# EasyEDA Pro project Z轴转接板-光耦.eprj

# Schematic 原理图

## Sheets
1 主控MCU: Board Name: XZ转接板; Create Date: 2024-04-22; Page Name: 主控MCU; Project Name: XZ转接板; Schematic Name: 原理图; Update Date: 2025-05-16; Company: 嘉立创EDA; Page Size: A3; Version: V1.0
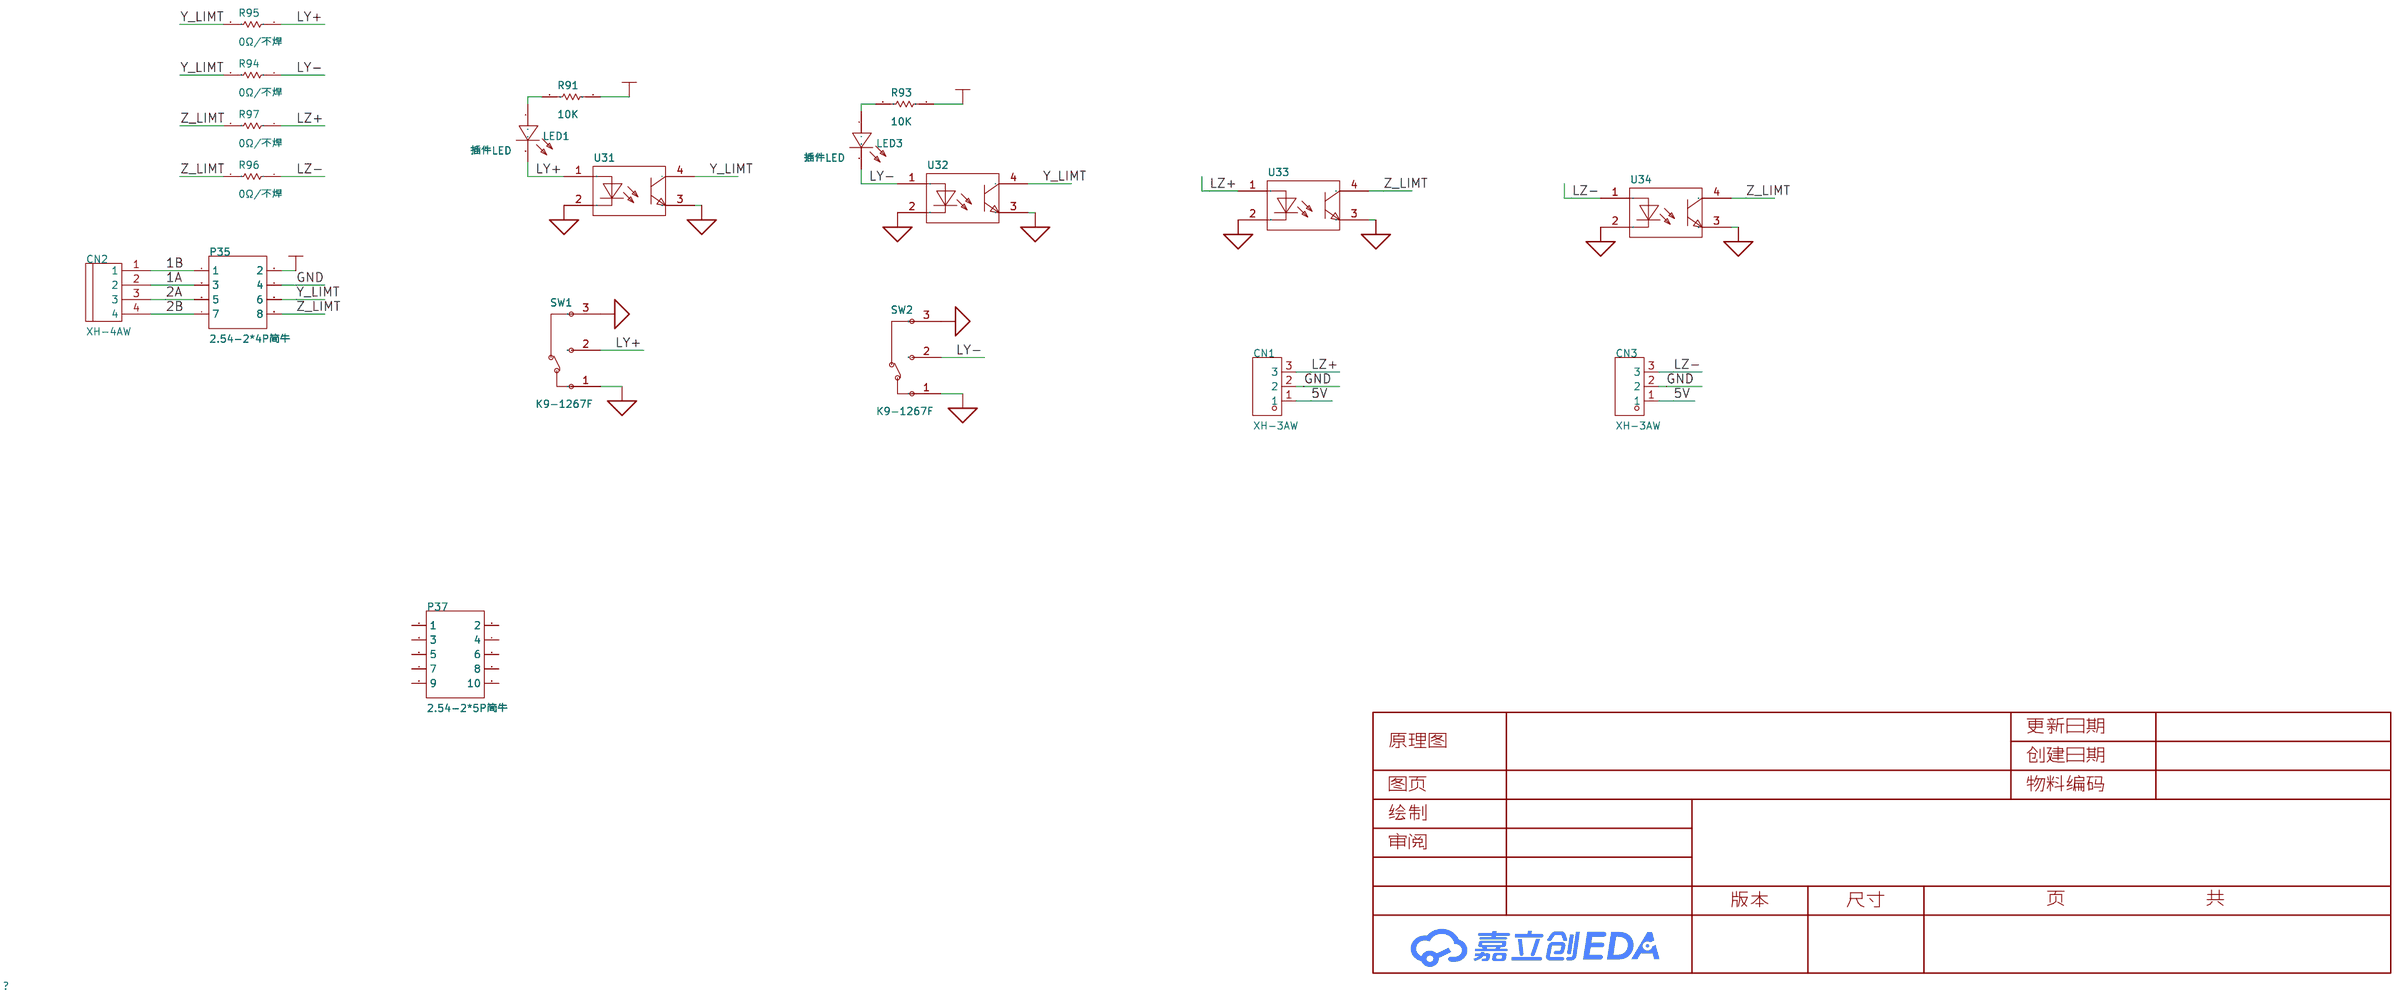
[diagram p0: 主控MCU]
2 电源及控制: Board Name: 转接隔离板; Create Date: 2024-12-30; Page Name: 电源及控制; Project Name: 延时继电器; Update Date: 2025-04-08
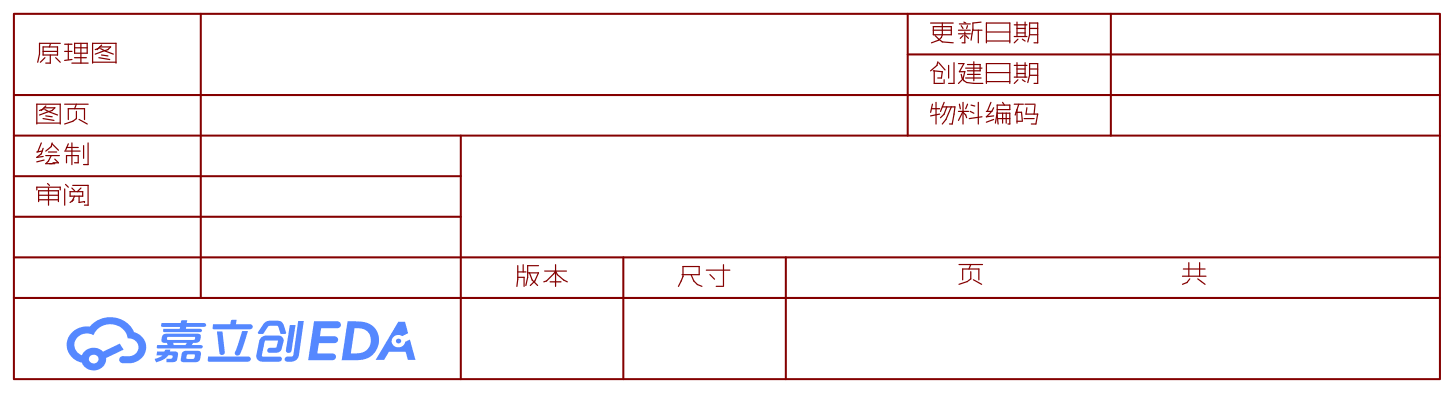
[diagram p1: 电源及控制]

## Parts
CN1  XH-3AW  [CONN-TH_3P-P2.50_XH-3A]
CN2  XH-4AW  [CONN-TH_XH2.54-4AW]
CN3  XH-3AW  [CONN-TH_3P-P2.50_XH-3A]
LED1  插件LED  [LED-TH_BD3.8-P2.54-FD]
LED3  插件LED  [LED-TH_BD3.8-P2.54-FD]
P35  2.54-2*4P简牛  [IDC-TH_8P-P2.54-V-R2-C4-S2.54]
P37  2.54-2*5P简牛  [IDC-TH_10P-P2.54_C5665]
R91  10K  [0603R]
R93  10K  [0603R]
R94  0Ω/不焊  [0603R]
R95  0Ω/不焊  [0603R]
R96  0Ω/不焊  [0603R]
R97  0Ω/不焊  [0603R]
SW1  K9-1267F  [SW-TH_K9-1267F]
SW2  K9-1267F  [SW-TH_K9-1267F]
U31  LTV-357T-C  [SOP-4_L4.4-W3.9-P2.54-LS7.0-TL]
U32  LTV-357T-C  [SOP-4_L4.4-W3.9-P2.54-LS7.0-TL]
U33  LTV-357T-C  [SOP-4_L4.4-W3.9-P2.54-LS7.0-TL]
U34  LTV-357T-C  [SOP-4_L4.4-W3.9-P2.54-LS7.0-TL]

## Library data of the parts
CN1 CN3 = XH-3AW: LCSC Part Name: XH-3AW，3P，脚距2.5mm，卧插 卧插; Supplier Part: C18428; Manufacturer: BOOMELE(博穆精密); Supplier Footprint: 插件,P=2.5mm; JLCPCB Part Class: Extended Part; Datasheet: https://atta.szlcsc.com/upload/public/pdf/source/20151222/1457707638029.pdf; Supplier: LCSC; Reference Series: XH; Pitch: 2.5mm; Pins Structure: 1x3P; Number of Rows: 1; Number of PINs Per Row: 3
CN2 = XH-4AW: LCSC Part Name: XH-4AW，4P，脚距2.5mm，卧插; Supplier Part: C21273; Manufacturer: BOOMELE(博穆精密); Supplier Footprint: 插件,P=2.5mm; JLCPCB Part Class: Extended Part; Datasheet: https://atta.szlcsc.com/upload/public/pdf/source/20170919/C21273_1505787293543977054.pdf; Supplier: LCSC; Reference Series: XH; Pitch: 2.5mm; Pins Structure: 1x4P; Number of Rows: 1; Number of PINs Per Row: 4; Contact Material: 磷青铜
LED1 LED3 = 204-10SURC/S530-A3-L: LCSC Part Name: 红灯; Supplier Part: C264302; Manufacturer: EVERLIGHT(台湾亿光); Supplier Footprint: 插件,D=3mm; JLCPCB Part Class: Extended Part; Datasheet: https://atta.szlcsc.com/upload/public/pdf/source/20181204/C264302_3C164FC09690301AE5D79DE2C4875559.pdf; Supplier: LCSC; Emitted Color: 红灯
P35 = 2.54-2*4P简牛: LCSC Part Name: 2.54mm 每排P数:4 排数:2; Supplier Part: C9135; Manufacturer: BOOMELE(博穆精密); Supplier Footprint: 插件,P=2.54mm; JLCPCB Part Class: Extended Part; Datasheet: https://atta.szlcsc.com/upload/public/pdf/source/20131122/1457706661290.pdf; Supplier: LCSC; Connector Type: 简牛座; Pitch: 2.54mm; Pin Number in each Row: 4; Number of Rows: 2; Row Spacing: 2.54mm; Holder Type: 直插
P37 = 2.54-2*5P简牛: LCSC Part Name: 2.54mm 每排P数:5 排数:2; Supplier Part: C5665; Manufacturer: BOOMELE(博穆精密); Supplier Footprint: 插件,P=2.54mm; JLCPCB Part Class: Extended Part; Datasheet: https://atta.szlcsc.com/upload/public/pdf/source/20140331/1457707037896.pdf; Supplier: LCSC; Connector Type: 简牛座; Pitch: 2.54mm; Pin Number in each Row: 5; Number of Rows: 2; Row Spacing: 2.54mm; Holder Type: 直插
R91 R93-R97 = 1K: Resistor; Published: 8-Jun-2000; LatestRevisionDate: 17-Jul-2002; LatestRevisionNote: Re-released for DXP Platform.; PackageReference: AXIAL-0.3; Publisher: Altium Limited; Origin Footprint 2: AXIAL-0.3; Origin Footprint 3: R0805; Origin Footprint 4: 0805R; Design Item ID: RES; Library Name: SCH封装库
SW1 SW2 = K9-1267F: LCSC Part Name: 弧形压柄300万次寿命小微动 12.7mm*5.7mm; Supplier Part: C107263; Manufacturer: 韩国韩荣; Supplier Footprint: 插件; JLCPCB Part Class: Extended Part; Datasheet: https://atta.szlcsc.com/upload/public/pdf/source/20201214/C107263_D9656DE761E5BF43078859A56D7E33A8.pdf; Supplier: LCSC; Type: 微动开关; Contact Current (DC): 100mA; Voltage Rating (DC): 30V; Contact Current (AC): 1A; Voltage Rating (AC): 125V; Circuit: 单刀双掷; Mechanical Life: 3000000; Operating Temperature: -25℃~+85℃; Switch Length: 12.7mm; Switch Width: 5.7mm; Switch Height: 12.8mm
U31-U34 = LTV-357T-C: 输入电压类型:DC;正向电压:1.2V;输出电流:50mA;隔离电压(rms):3.75kV;反向电压:6V;接收端电压:35V;输出通道数:1;集射极饱和电压(Vce(sat)@Ic,IF):200mV@1mA,20mA;; Supplier: LCSC; Manufacturer: LITEON(光宝); Supplier Part: C119091; JLCPCB Part Class: 扩展库; LCSC Part Name: DC输入隔离电压(rms):3750V; Supplier Footprint: SOP-4-2.54mm; Datasheet: https://atta.szlcsc.com/upload/public/pdf/source/20170930/C133128_1506736380934997376.pdf; Input voltage type: DC; Output Type: 光电三极管; Forward Voltage: 1.2V; Output Current: 50mA; Isolation Voltage(rms): 3.75kV; Reverse Voltage: 6V; Receiving End Voltage: 35V; Number of Outputs: 1; Collector-Emitter Saturation Voltage (Vce(sat)@Ic,IF): 200mV@1mA,20mA; Rise time: 4us@2mA,100Ω; Fall time: 3us@2mA,100Ω; Operating Temperature: -55℃~+110℃

## Nets
5V: CN1.1 CN3.1 P35.2 R91.1 R93.1
GND: CN1.2 CN3.2 P35.4 SW1.1(C) SW1.3(NC) SW2.1(C) SW2.3(NC) U31.2 U31.3 U32.2 U32.3 U33.2 U33.3 U34.2 U34.3
1A: CN2.2 P35.3
1B: CN2.1 P35.1
2A: CN2.3 P35.5
2B: CN2.4 P35.7
LY+: LED1.2(K) R95.1 SW1.2(NO) U31.1
LY-: LED3.2(K) R94.1 SW2.2(NO) U32.1
LZ+: CN1.3 R97.1 U33.1
LZ-: CN3.3 R96.1 U34.1
Y_LIMT: P35.6 R94.2 R95.2 U31.4 U32.4
Z_LIMT: P35.8 R96.2 R97.2 U33.4 U34.4
$1N78046: LED1.1(A) R91.2
$1N78221: LED3.1(A) R93.2

Not connected (* = marked no-connect by the designer): P37 1 2 3 4 5 6 7 8 9 10

# Board PCB
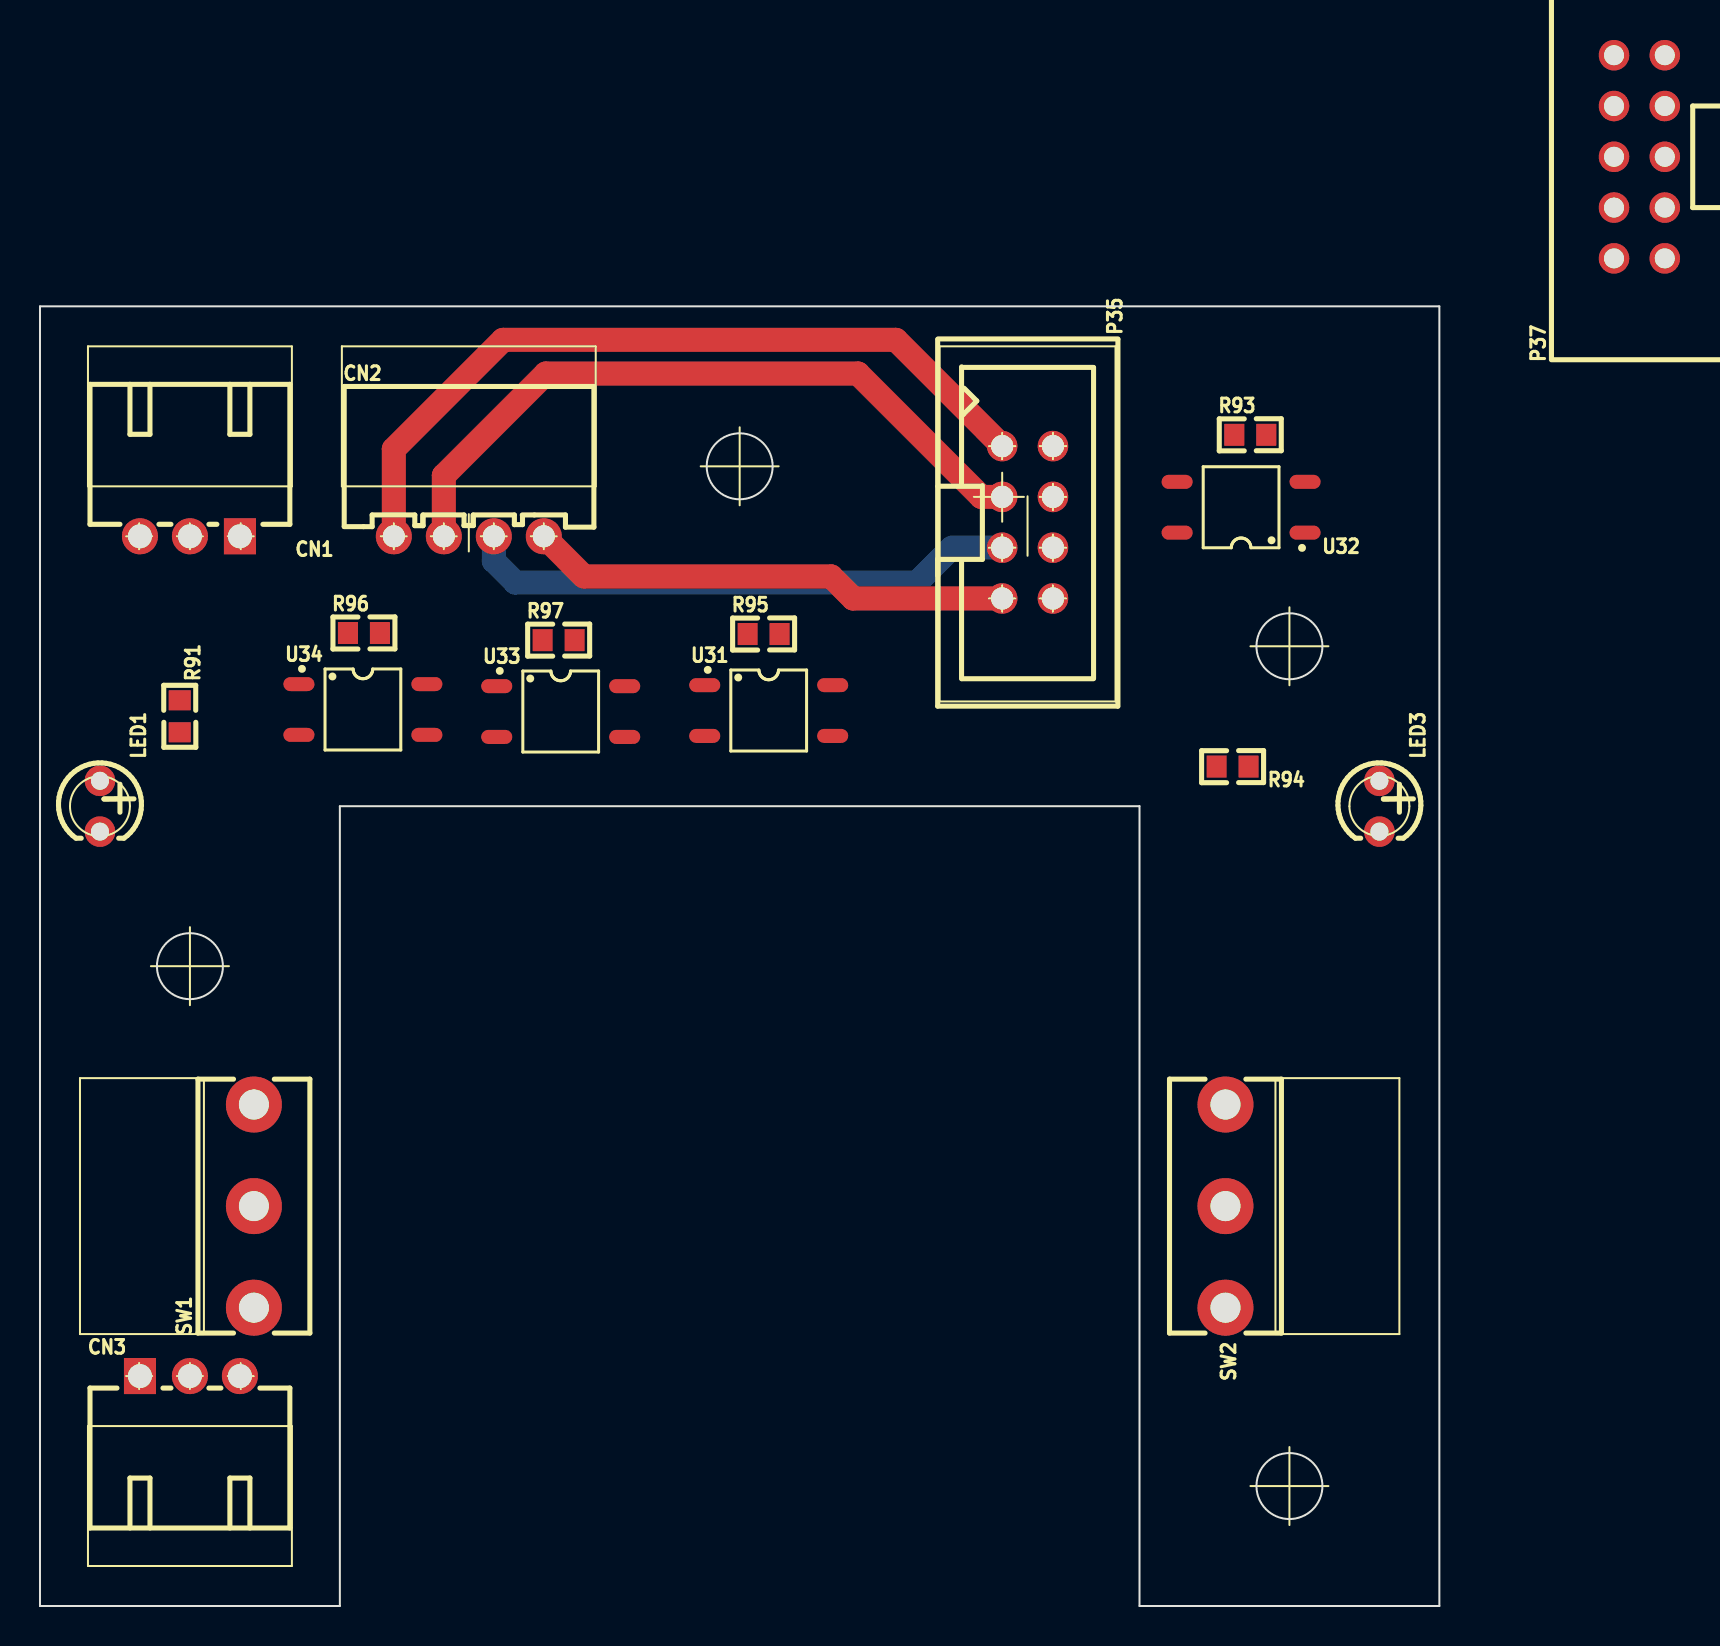
[diagram p2: board, top side]
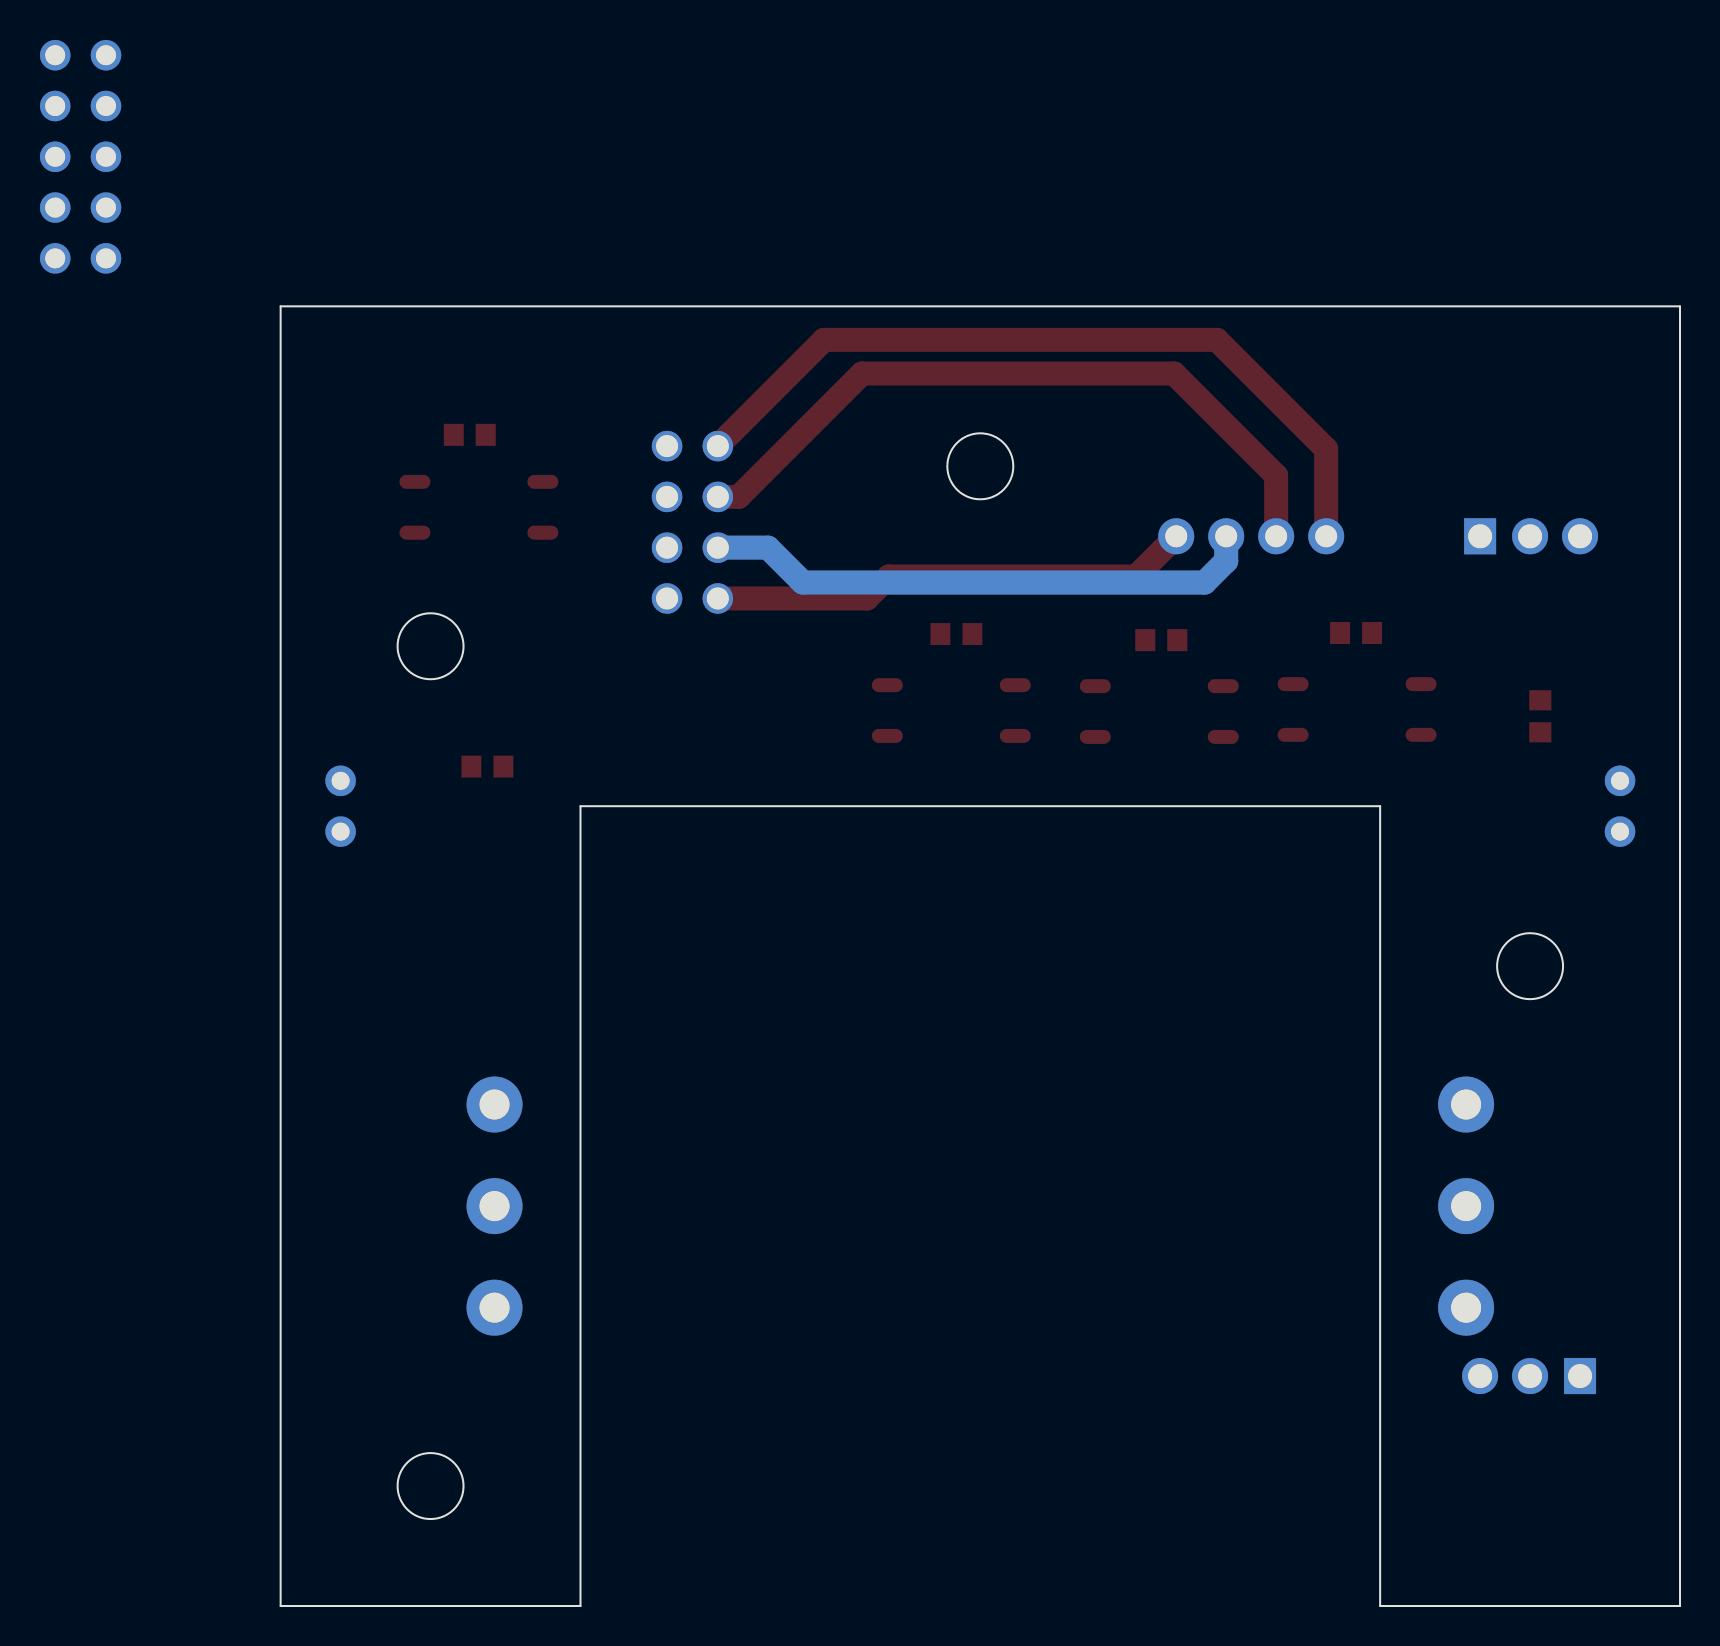
[diagram p3: board, bottom side, seen from below]

Outline 70 x 65 mm; copper layers: Top Layer, Bottom Layer. Coordinates in mm from the lower left corner of the outline.
Outline path: circle c7.5,32 r1.65 ; circle c35,57 r1.65 ; circle c62.5,48 r1.65 ; circle c62.5,6 r1.65 ; 0,65 0,0 15,0 15,40 55,40 55,0 70,0 70,65 0,65
Stack: Top Layer 0.035mm / Dielectric1 1.51mm FR4 er 4.5 / Bottom Layer 0.035mm

## Design rules (mm)
template: 用户自定义配置
spacing Default (default): track to track 0.152, other pairs 0 to 0.152
track width Default (default): min 0.254, default 0.254, max 25.4
differential pair differentialPair (default): width min 0.127, default 0.254, max 2.54; gap min 0.152, default 0.152
via Default (default): diameter min 0.25, default 0.61, max 100.025; hole min 0.2, default 0.305, max 59.995

## Placement (name value [footprint] x y rotation side)
CN1  XH-3AW  [CONN-TH_3P-P2.50_XH-3A]  7.5 53.5 180 top
CN2  XH-4AW  [CONN-TH_XH2.54-4AW]  21.45 53.5 0 top
CN3  XH-3AW  [CONN-TH_3P-P2.50_XH-3A]  7.5 11.5 0 top
LED1  插件LED  [LED-TH_BD3.8-P2.54-FD]  3 40 270 top
LED3  插件LED  [LED-TH_BD3.8-P2.54-FD]  67 40 270 top
P35  2.54-2*4P简牛  [IDC-TH_8P-P2.54-V-R2-C4-S2.54]  49.4 54.2 270 top
P37  2.54-2*5P简牛  [IDC-TH_10P-P2.54_C5665]  80.01 72.48 90 top
R91  10K  [0603R]  6.99 44.5 270 top
R93  10K  [0603R]  60.54 58.57 0 top
R94  0Ω/不焊  [0603R]  59.66 41.98 180 top
R95  0Ω/不焊  [0603R]  36.2 48.61 0 top
R96  0Ω/不焊  [0603R]  16.2 48.66 0 top
R97  0Ω/不焊  [0603R]  25.95 48.31 0 top
SW1  K9-1267F  [SW-TH_K9-1267F]  10.7 20 90 top
SW2  K9-1267F  [SW-TH_K9-1267F]  59.3 20 90 top
U31  LTV-357T-C  [SOP-4_L4.4-W3.9-P2.54-LS7.0-TL]  36.45 44.79 0 top
U32  LTV-357T-C  [SOP-4_L4.4-W3.9-P2.54-LS7.0-TL]  60.08 54.95 180 top
U33  LTV-357T-C  [SOP-4_L4.4-W3.9-P2.54-LS7.0-TL]  26.05 44.74 0 top
U34  LTV-357T-C  [SOP-4_L4.4-W3.9-P2.54-LS7.0-TL]  16.15 44.84 0 top

## Footprints (pads in the part's own frame, mm; a bottom-side part is the same pattern mirrored in y, then rotated)
0603R
  rect 1x1.1 smd: 1(-0.8,0) 2(0.8,0)
CONN-TH_3P-P2.50_XH-3A
  rect 1.6x1.801 hole 1.199: 1(-2.499,0)
  round 1.801 hole 1.199: 2(0,0) 3(2.499,0)
CONN-TH_XH2.54-4AW
  round 1.8 hole 1.1: 1(-3.751,0) 2(-1.248,0) 3(1.251,0) 4(3.751,0)
IDC-TH_8P-P2.54-V-R2-C4-S2.54
  round 1.524 hole 1.1: 1(-3.81,-1.27) 2(-3.81,1.27) 3(-1.27,-1.27) 4(-1.27,1.27) 5(1.27,-1.27) 6(1.27,1.27) 7(3.81,-1.27) 8(3.81,1.27)
IDC-TH_10P-P2.54_C5665
  round 1.524 hole 1: 1(-5.08,-1.27) 2(-5.08,1.27) 3(-2.54,-1.27) 4(-2.54,1.27) 5(0,-1.27) 6(0,1.27) 7(2.54,-1.27) 8(2.54,1.27) 9(5.08,-1.27) 10(5.08,1.27)
LED-TH_BD3.8-P2.54-FD
  round 1.524 hole 0.9: 1(-1.27,0) 2(1.27,0)
SOP-4_L4.4-W3.9-P2.54-LS7.0-TL
  oval 1.55x0.7 smd: 1(-3.2,1.27) 2(-3.2,-1.27) 3(3.2,-1.27) 4(3.2,1.27)
SW-TH_K9-1267F
  round 2.799 hole 1.501: 1(-5.08,0) 2(0,0) 3(5.08,0)

## Nets
As in the schematic.

Pads without a net: P37 1 2 3 4 5 6 7 8 9 10

## Routing (per net, layer and track width the routed paths; a pad name or vN(x,y) marks a point on that pad's centre or on a via; arc(x,y) is an arc through that point)
1A: length 35.6
  Top Layer w1.2: P35.3 47.09,55.47 40.92,61.64 25.31,61.64 20.2,56.54 CN2.2
1B: length 39.3
  Top Layer w1.2: P35.1 42.82,63.32 23.16,63.32 17.7,57.86 CN2.1
2A: length 27.8
  Bottom Layer w1.2: CN2.3 22.7,52.26 23.78,51.19 43.87,51.19 45.62,52.93 48.13,52.93
2B: length 24.2
  Top Layer w1.2: 25.2,53.5 27.21,51.49 39.57,51.49 40.67,50.39 P35.7

## Copper pours and planes (outline as drawn; the poured copper is in the pictures)
SGND on Top Layer: -203.57,-35.33 -136.45,-35.33 -136.45,-110.71 -203.57,-110.71
SGND on Bottom Layer: -202.95,-35.23 -136.81,-35.23 -136.81,-111.01 -202.95,-111.01
